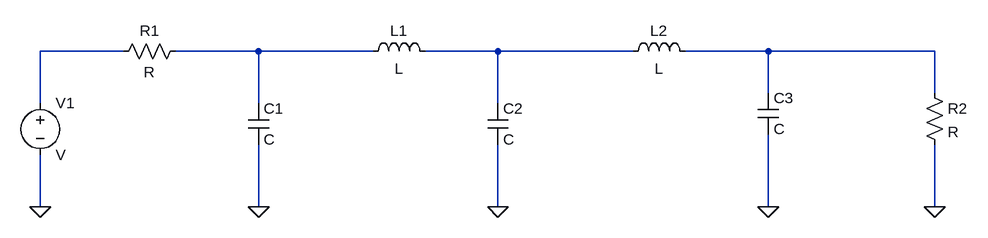
[diagram p0: schematic passive anti aliasing filter 1kHz.asc]
passive anti aliasing filter 1kHz.asc, the LTspice schematic file:
Version 4
SHEET 1 1512 680
WIRE 208 48 80 48
WIRE 416 48 288 48
WIRE 592 48 416 48
WIRE 784 48 672 48
WIRE 992 48 784 48
WIRE 1200 48 1072 48
WIRE 1456 48 1200 48
WIRE 1200 112 1200 48
WIRE 1456 112 1456 48
WIRE 80 128 80 48
WIRE 416 128 416 48
WIRE 784 128 784 48
WIRE 80 288 80 208
WIRE 416 288 416 192
WIRE 784 288 784 192
WIRE 1200 288 1200 176
WIRE 1456 288 1456 192
FLAG 80 288 0
FLAG 416 288 0
FLAG 784 288 0
FLAG 1200 288 0
FLAG 1456 288 0
SYMBOL voltage 80 112 R0
SYMATTR InstName V1
SYMBOL res 304 32 R90
WINDOW 0 0 56 VBottom 2
WINDOW 3 32 56 VTop 2
SYMATTR InstName R1
SYMBOL cap 400 128 R0
SYMATTR InstName C1
SYMBOL ind 576 64 R270
WINDOW 0 32 56 VTop 2
WINDOW 3 5 56 VBottom 2
SYMATTR InstName L1
SYMBOL cap 768 128 R0
SYMATTR InstName C2
SYMBOL ind 976 64 R270
WINDOW 0 32 56 VTop 2
WINDOW 3 5 56 VBottom 2
SYMATTR InstName L2
SYMBOL cap 1184 112 R0
SYMATTR InstName C3
SYMBOL res 1440 96 R0
SYMATTR InstName R2

The netlist it stands for:
* passive anti aliasing filter 1kHz.asc
V1 N001 0 V
R1 N002 N001 R
C1 N002 0 C
L1 N002 N003 L
C2 N003 0 C
L2 N003 N004 L
C3 N004 0 C
R2 N004 0 R
.backanno
.end